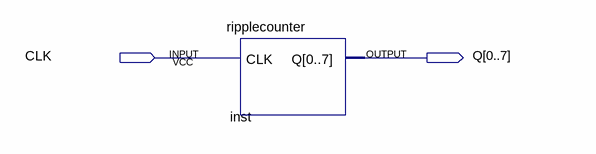
[diagram p0: schematic sheet]
// Quartus schematic ripplecounter2.bdf as structural Verilog: 1 symbols, 2 pins
module ripplecounter2 (
  input  CLK,
  output [0:7] Q
);

  ripplecounter inst (.CLK(CLK), .Q(Q));
endmodule
